# Altium schematic sheet 03_Block diagram.SchDoc: C200
size 297 x 209 mm; Page Create Date: March  8, 1995; Page Number: 3; Page Size: A4; Comment: radxa_1010; Page Count: 21; RevCode: V1.11; Doc: 03_Block diagram; DsnPath: D:\WMS\C200\CC122\对外\C200 V1.11.DSN; SchematicName: c200; PageName: 03_Block diagram; PageSize: A4; TopSchematic: True
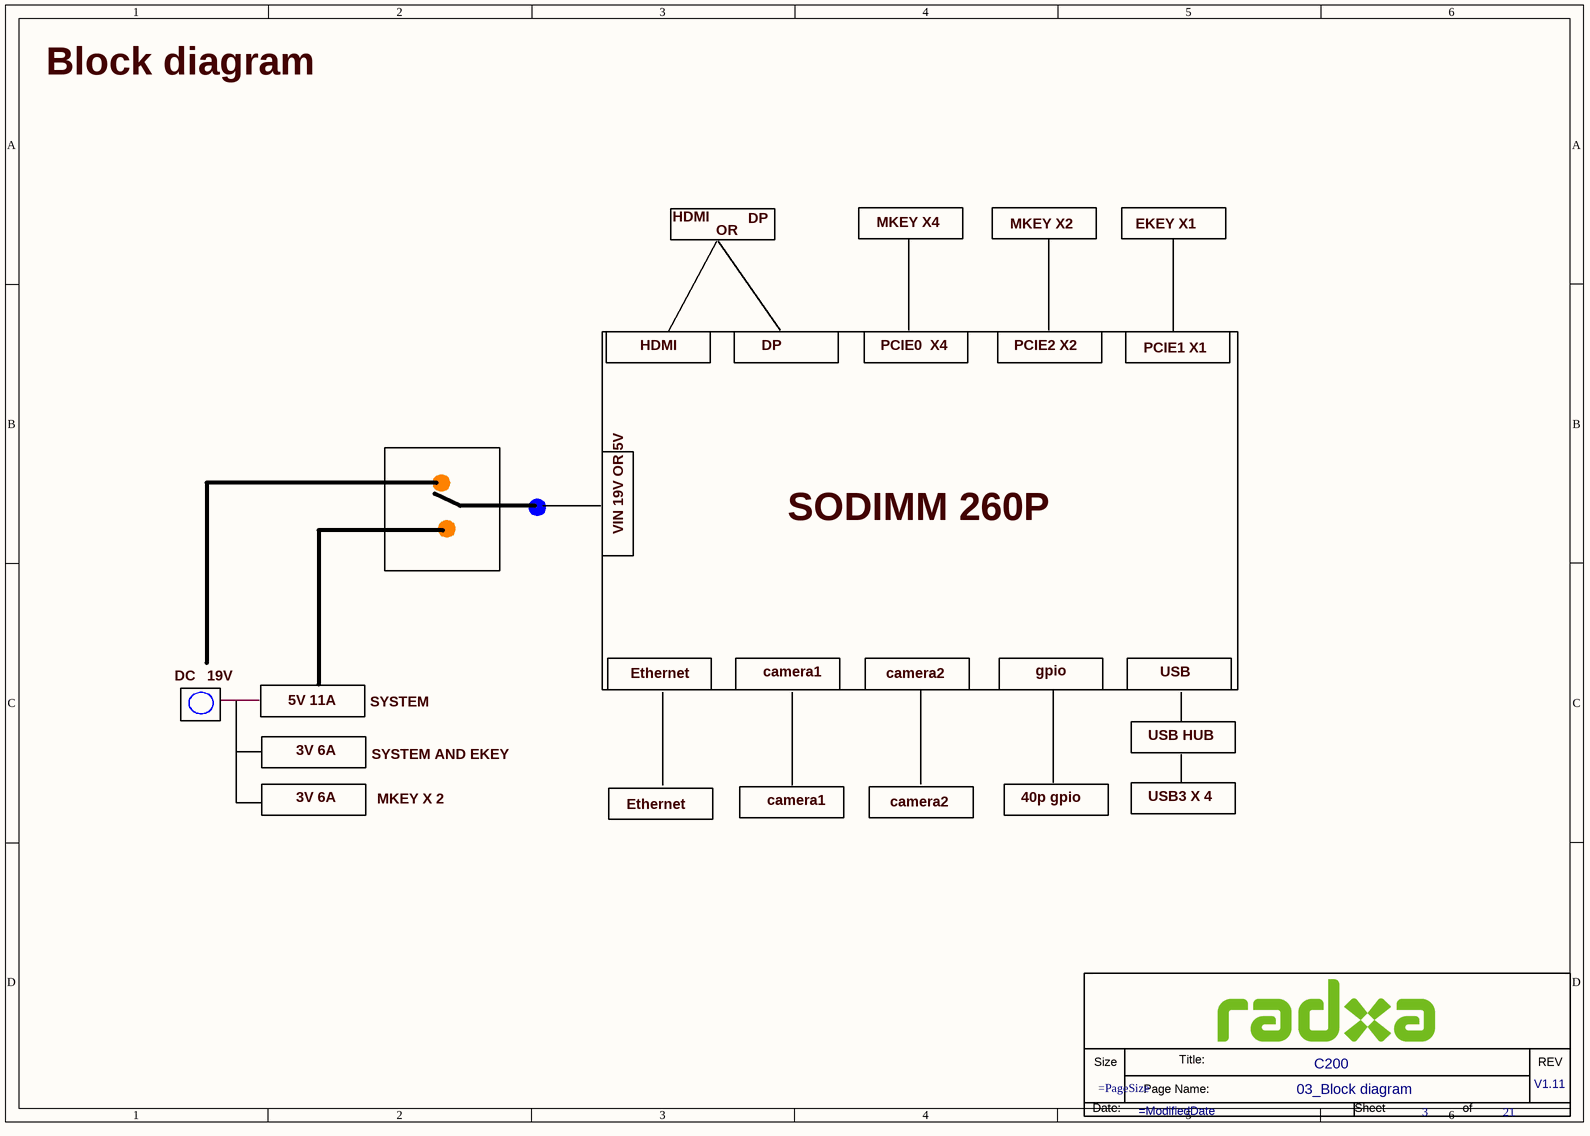
[diagram p0: 03_Block diagram.SchDoc]

## Parts
*  Doc: 03_Block diagram  RevCode: V1.11  Title: C200  Page Number: 3  Page Count: 21  (hidden comment: radxa_1010)  (graphical)

## Notes on the sheet
- Block diagram
- HDMI
- OR
- DP
- MKEY X4
- MKEY X2
- EKEY X1
- PCIE0  X4
- PCIE2 X2
- PCIE1 X1
- VIN 19V OR 5V
- SODIMM 260P
- camera1
- gpio
- USB
- DC
- 19V
- 5V 11A
- SYSTEM
- Ethernet
- camera2
- USB HUB
- 3V 6A
- SYSTEM AND EKEY
- MKEY X 2
- 40p gpio
- USB3 X 4
- (in symbol radxa_1010) Size; Title:; REV; Page Name:; Date:; Sheet; of

## Library data of the parts
* = radxa_1010: Page Create Date: March  8, 1995; Page Size: =PageSize; Page Modify Date: =ModifiedDate